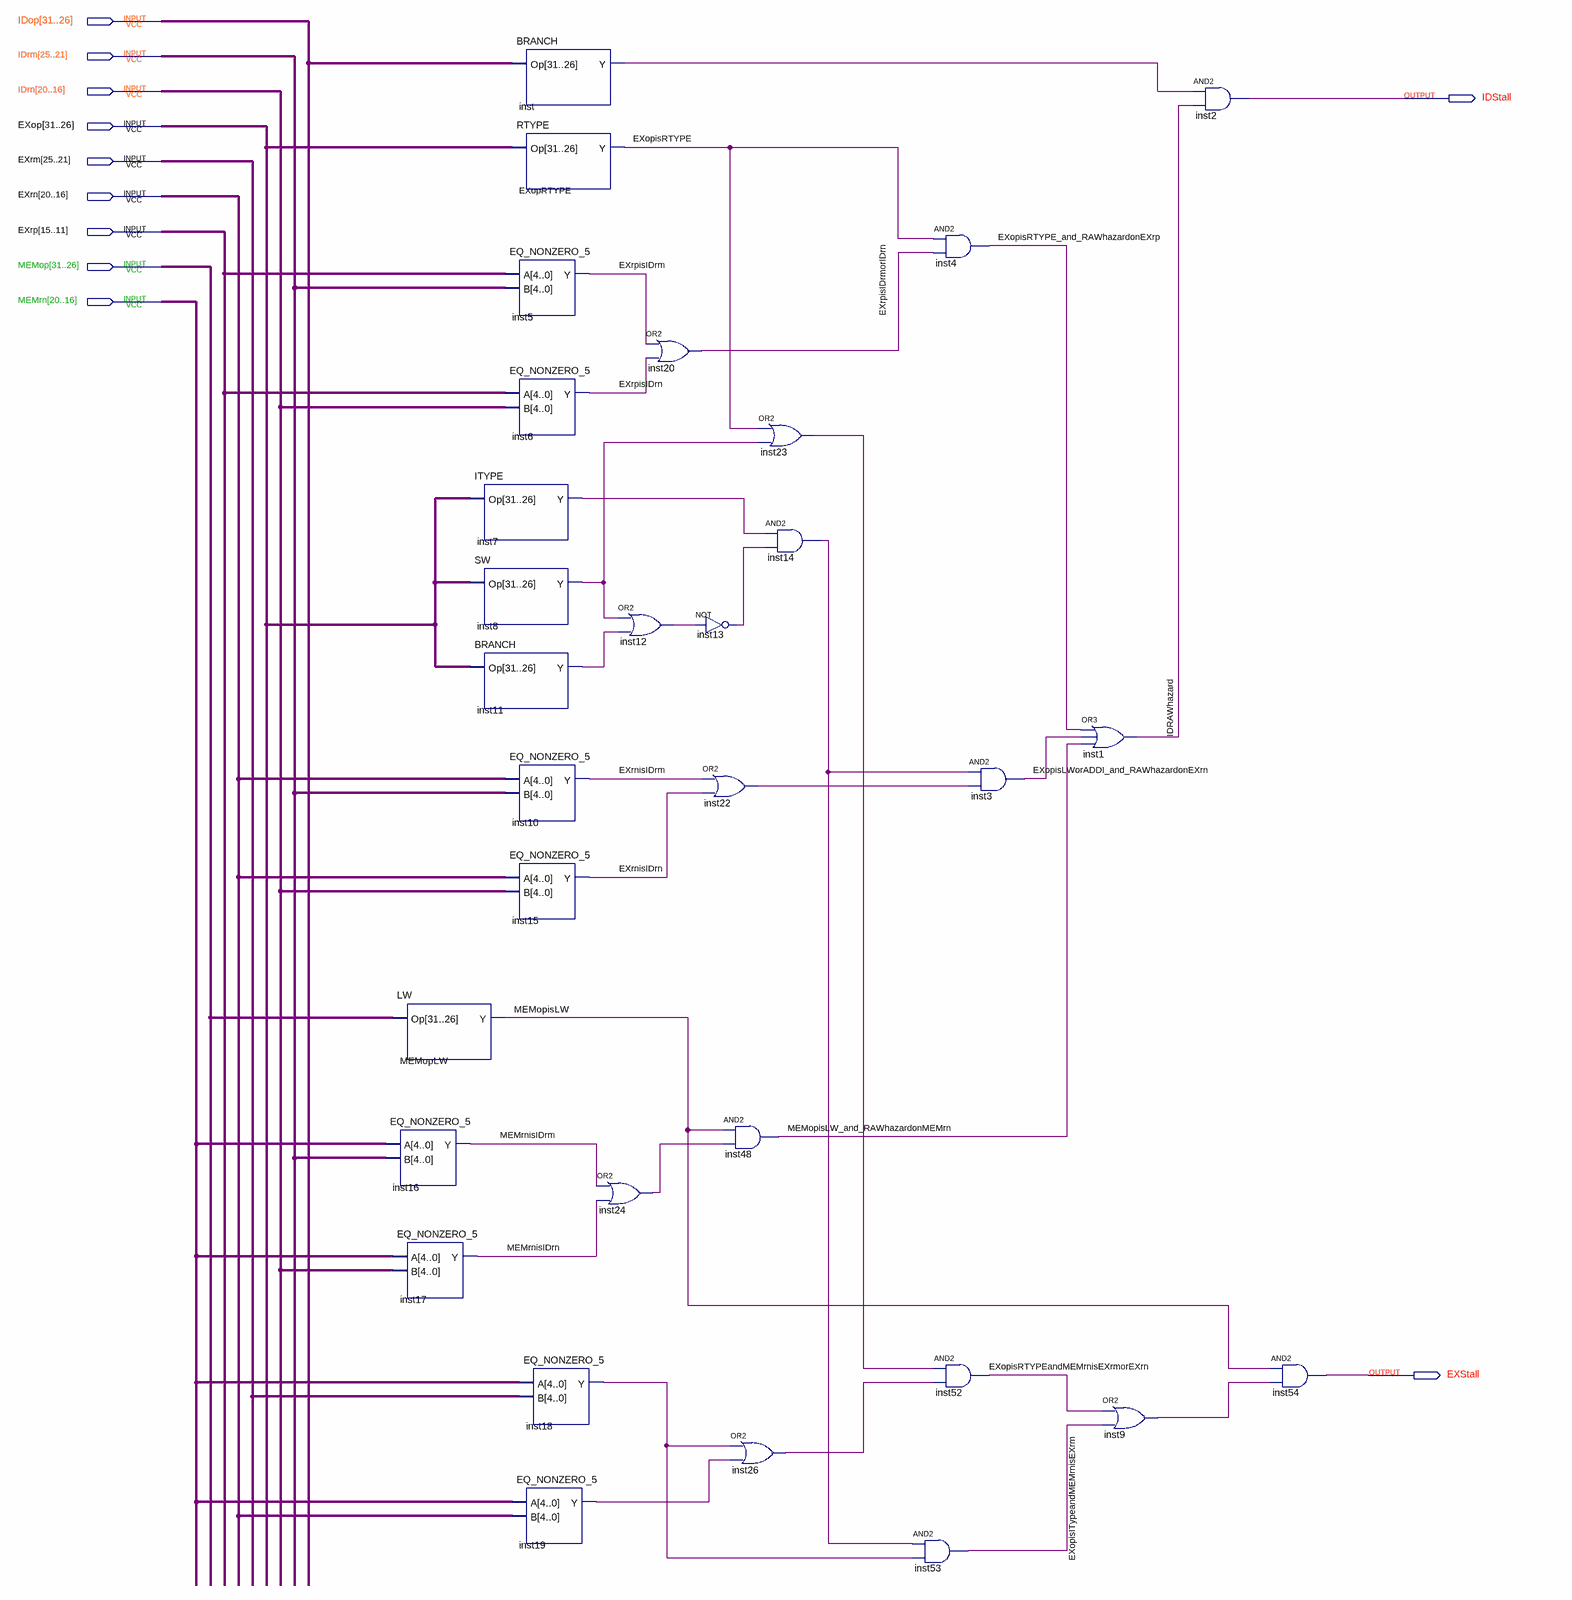
[diagram p0: schematic sheet]
// Quartus schematic StallDetection.bdf as structural Verilog: 31 symbols, 11 pins
module StallDetection (
  input  [31:26] IDop,
  input  [25:21] IDrm,
  input  [20:16] IDrn,
  input  [31:26] EXop,
  input  [25:21] EXrm,
  input  [20:16] EXrn,
  input  [15:11] EXrp,
  input  [31:26] MEMop,
  input  [20:16] MEMrn,
  output IDStall,
  output EXStall
);

  wire EXopisITypeandMEMrnisEXrm, EXopisLWorADDI_and_RAWhazardonEXrn, EXopisRTYPE,
       EXopisRTYPE_and_RAWhazardonEXrp, EXopisRTYPEandMEMrnisEXrmorEXrn, EXrnisIDrm, EXrnisIDrn, EXrpisIDrm,
       EXrpisIDrmorIDrn, EXrpisIDrn, IDRAWhazard, inst7_y, inst8_y, inst9_out, inst11_y, inst12_out,
       inst13_out, inst14_out, inst18_y, inst19_y, inst22_out, inst23_out, inst24_out, inst26_out, inst_y,
       MEMopisLW, MEMopisLW_and_RAWhazardonMEMrn, MEMrnisIDrm, MEMrnisIDrn;

  LW MEMopLW (.Op(MEMop), .Y(MEMopisLW));
  EQ_NONZERO_5 inst16 (.A(MEMrn), .B(IDrm), .Y(MEMrnisIDrm));
  EQ_NONZERO_5 inst17 (.A(MEMrn), .B(IDrn), .Y(MEMrnisIDrn));
  BRANCH inst (.Op(IDop), .Y(inst_y));
  RTYPE EXopRTYPE (.Op(EXop), .Y(EXopisRTYPE));
  EQ_NONZERO_5 inst5 (.A(EXrp), .B(IDrm), .Y(EXrpisIDrm));
  EQ_NONZERO_5 inst6 (.A(EXrp), .B(IDrn), .Y(EXrpisIDrn));
  ITYPE inst7 (.Op(EXop), .Y(inst7_y));
  SW inst8 (.Op(EXop), .Y(inst8_y));
  BRANCH inst11 (.Op(EXop), .Y(inst11_y));
  EQ_NONZERO_5 inst10 (.A(EXrn), .B(IDrm), .Y(EXrnisIDrm));
  EQ_NONZERO_5 inst15 (.A(EXrn), .B(IDrn), .Y(EXrnisIDrn));
  EQ_NONZERO_5 inst19 (.A(MEMrn), .B(EXrn), .Y(inst19_y));
  EQ_NONZERO_5 inst18 (.A(MEMrn), .B(EXrm), .Y(inst18_y));
  or inst12 (inst12_out, inst8_y, inst11_y);
  or inst24 (inst24_out, MEMrnisIDrm, MEMrnisIDrn);
  or inst20 (EXrpisIDrmorIDrn, EXrpisIDrm, EXrpisIDrn);
  not inst13 (inst13_out, inst12_out);
  or inst22 (inst22_out, EXrnisIDrm, EXrnisIDrn);
  and inst48 (MEMopisLW_and_RAWhazardonMEMrn, MEMopisLW, inst24_out);
  or inst26 (inst26_out, inst18_y, inst19_y);
  or inst23 (inst23_out, EXopisRTYPE, inst8_y);
  and inst14 (inst14_out, inst7_y, inst13_out);
  and inst4 (EXopisRTYPE_and_RAWhazardonEXrp, EXopisRTYPE, EXrpisIDrmorIDrn);
  and inst52 (EXopisRTYPEandMEMrnisEXrmorEXrn, inst23_out, inst26_out);
  and inst53 (EXopisITypeandMEMrnisEXrm, inst14_out, inst18_y);
  and inst3 (EXopisLWorADDI_and_RAWhazardonEXrn, inst14_out, inst22_out);
  or inst1 (IDRAWhazard, EXopisRTYPE_and_RAWhazardonEXrp, EXopisLWorADDI_and_RAWhazardonEXrn, MEMopisLW_and_RAWhazardonMEMrn);
  or inst9 (inst9_out, EXopisRTYPEandMEMrnisEXrmorEXrn, EXopisITypeandMEMrnisEXrm);
  and inst2 (IDStall, inst_y, IDRAWhazard);
  and inst54 (EXStall, MEMopisLW, inst9_out);
endmodule
